# Altium project DTCP v2.0.PrjPcb
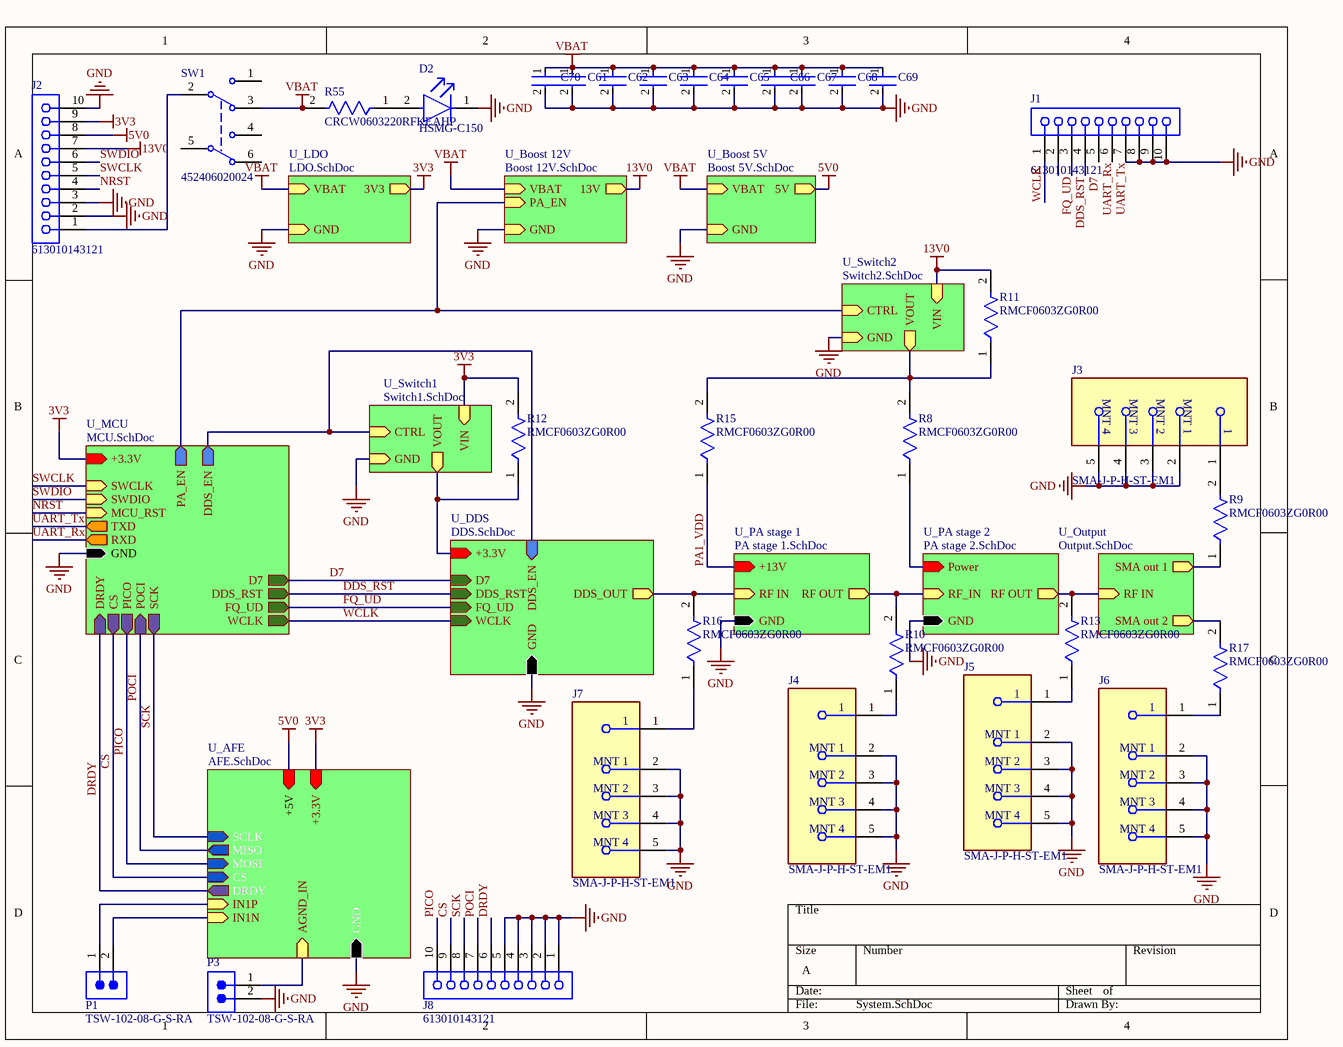
[diagram p0: System.SchDoc]
6 sheets, 109 parts. Net scope: hierarchical (ports join the sheet entries above them; power ports are global).
Board file: PCB1.PcbDoc
Sheets:
  System.SchDoc
    U_MCU = MCU.SchDoc
    U_DDS = DDS.SchDoc
    U_PA stage 2 = PA stage 2.SchDoc
    U_Output = Output.SchDoc
    U_AFE = AFE.SchDoc

## Sheet System.SchDoc
size A; SheetNumber: 1; SheetTotal: 12

### Parts
C61  GRM21BR60J107ME15K  [FP-GRM21B-0_2-e0_2_0_7-IPC_B]  (value not drawn)
C62  GRM21BR60J107ME15K  [FP-GRM21B-0_2-e0_2_0_7-IPC_B]  (value not drawn)
C63  GRM21BR60J107ME15K  [FP-GRM21B-0_2-e0_2_0_7-IPC_B]  (value not drawn)
C64  GRM21BR60J107ME15K  [FP-GRM21B-0_2-e0_2_0_7-IPC_B]  (value not drawn)
C65  GRM21BR60J107ME15K  [FP-GRM21B-0_2-e0_2_0_7-IPC_B]  (value not drawn)
C66  GRM21BR60J107ME15K  [FP-GRM21B-0_2-e0_2_0_7-IPC_B]  (value not drawn)
C67  GRM21BR60J107ME15K  [FP-GRM21B-0_2-e0_2_0_7-IPC_B]  (value not drawn)
C68  GRM21BR60J107ME15K  [FP-GRM21B-0_2-e0_2_0_7-IPC_B]  (value not drawn)
C69  GRM21BR60J107ME15K  [FP-GRM21B-0_2-e0_2_0_7-IPC_B]  (value not drawn)
C70  GRM21BR60J107ME15K  [FP-GRM21B-0_2-e0_2_0_7-IPC_B]  (value not drawn)
D2  HSMG-C150  [FP-HSMG-C150-MFG]
J1  613010143121  [613010143121]
J2  613010143121  [613010143121]
J3  SMA-J-P-H-ST-EM1  [FP-SMA-J-P-H-ST-EM1-MFG]
J4  SMA-J-P-H-ST-EM1  [FP-SMA-J-P-H-ST-EM1-MFG]
J5  SMA-J-P-H-ST-EM1  [FP-SMA-J-P-H-ST-EM1-MFG]
J6  SMA-J-P-H-ST-EM1  [FP-SMA-J-P-H-ST-EM1-MFG]
J7  SMA-J-P-H-ST-EM1  [FP-SMA-J-P-H-ST-EM1-MFG]
J8  613010143121  [613010143121]
P1  TSW-102-08-G-S-RA  [SMTC-TSW-102-08-X-S-RA]
P3  TSW-102-08-G-S-RA  [SMTC-TSW-102-08-X-S-RA]
R8  RMCF0603ZG0R00  [FP-RMCF0603-IPC_B]
R9  RMCF0603ZG0R00  [FP-RMCF0603-IPC_B]
R10  RMCF0603ZG0R00  [FP-RMCF0603-IPC_B]
R11  RMCF0603ZG0R00  [FP-RMCF0603-IPC_B]
R12  RMCF0603ZG0R00  [FP-RMCF0603-IPC_B]
R13  RMCF0603ZG0R00  [FP-RMCF0603-IPC_B]
R15  RMCF0603ZG0R00  [FP-RMCF0603-IPC_B]
R16  RMCF0603ZG0R00  [FP-RMCF0603-IPC_B]
R17  RMCF0603ZG0R00  [FP-RMCF0603-IPC_B]
R55  CRCW0603220RFKEAHP  [FP-CRCW0603-HPe3-IPC_A]
SW1  452406020024  [452406020024]

### Sub-sheets
U_AFE = AFE.SchDoc: +5V (in), GND (in), +3.3V (in), DRDY (out), CS (in), SCLK (in), MISO (out), MOSI (in), IN1P (in), IN1N (in), AGND_IN (in)
U_Boost 5V = Boost 5V.SchDoc (file not in this document): VBAT (in), GND (in), 5V (out)
U_Boost 12V = Boost 12V.SchDoc (file not in this document): VBAT (in), GND (in), 13V (out), PA_EN (in)
U_DDS = DDS.SchDoc: DDS_OUT (out), D7 (in), DDS_RST (in), FQ_UD (in), WCLK (in), +3.3V (in), GND (in), DDS_EN (in)
U_LDO = LDO.SchDoc (file not in this document): VBAT (in), GND (in), 3V3 (out)
U_MCU = MCU.SchDoc: +3.3V (in), GND (in), SWCLK (in), SWDIO (in), MCU_RST (in), TXD (out), CS (out), PICO (out), POCI (in), SCK (out), D7 (out), DDS_RST (out), FQ_UD (out), WCLK (out), PA_EN (out), DDS_EN (out), DRDY (in), RXD (out)
U_Output = Output.SchDoc: RF IN (in), SMA out 1 (out), SMA out 2 (out)
U_PA stage 1 = PA stage 1.SchDoc (file not in this document): RF IN (in), RF OUT (out), GND (in), +13V (in)
U_PA stage 2 = PA stage 2.SchDoc: GND (in), RF OUT (out), Power (in), RF_IN (in)
U_Switch1 = Switch1.SchDoc (file not in this document): VIN (in), VOUT (out), CTRL (in), GND (in)
U_Switch2 = Switch2.SchDoc (file not in this document): VIN (in), VOUT (out), CTRL (in), GND (in)

### Nets
3V3: J2.9 R12.2 ; sheet U_MCU/+3.3V, sheet U_LDO/3V3, sheet U_Switch1/VIN, sheet U_AFE/+3.3V
3V3DDS: R12.1 ; sheet U_DDS/+3.3V, sheet U_Switch1/VOUT
5V0: J2.8 ; sheet U_Boost 5V/5V, sheet U_AFE/+5V
13V0: J2.7 R11.2 ; sheet U_Boost 12V/13V, sheet U_Switch2/VIN
13V0PA: R8.1 ; sheet U_PA stage 2/Power
GND: C61.2 C62.2 C63.2 C64.2 C65.2 C66.2 C67.2 C68.2 C69.2 C70.2 D2.1(C) J1.7 J1.8 J1.9 J1.10 J2.2 J2.3 J2.10 J3.2(MNT_1) J3.3(MNT_2) J3.4(MNT_3) J3.5(MNT_4) J4.2(MNT_1) J4.3(MNT_2) J4.4(MNT_3) J4.5(MNT_4) J5.2(MNT_1) J5.3(MNT_2) J5.4(MNT_3) J5.5(MNT_4) J6.2(MNT_1) J6.3(MNT_2) J6.4(MNT_3) J6.5(MNT_4) J7.2(MNT_1) J7.3(MNT_2) J7.4(MNT_3) J7.5(MNT_4) J8.1 J8.2 J8.3 J8.4 J8.5 P3.2 ; sheet U_MCU/GND, sheet U_DDS/GND, sheet U_PA stage 1/GND, sheet U_PA stage 2/GND, sheet U_LDO/GND, sheet U_Boost 12V/GND, sheet U_Switch1/GND, sheet U_Switch2/GND, sheet U_Boost 5V/GND, sheet U_AFE/GND
VBAT: C61.1 C62.1 C63.1 C64.1 C65.1 C66.1 C67.1 C68.1 C69.1 C70.1 R55.2 SW1.3 ; sheet U_LDO/VBAT, sheet U_Boost 12V/VBAT, sheet U_Boost 5V/VBAT
CS: J8.9 ; sheet U_MCU/CS, sheet U_AFE/CS
D7: J1.4 ; sheet U_MCU/D7, sheet U_DDS/D7
DDS_OUT: R16.2 ; sheet U_DDS/DDS_OUT, sheet U_PA stage 1/RF IN
DDS_RST: J1.3 ; sheet U_MCU/DDS_RST, sheet U_DDS/DDS_RST
DRDY: J8.6 ; sheet U_MCU/DRDY, sheet U_AFE/DRDY
FQ_UD: J1.2 ; sheet U_MCU/FQ_UD, sheet U_DDS/FQ_UD
IN-: P1.1 ; sheet U_AFE/IN1P
NRST: J2.4 ; sheet U_MCU/MCU_RST
PA1_VDD: R15.1 ; sheet U_PA stage 1/+13V
PICO: J8.10 ; sheet U_MCU/PICO, sheet U_AFE/MOSI
POCI: J8.7 ; sheet U_MCU/POCI, sheet U_AFE/MISO
SCK: J8.8 ; sheet U_MCU/SCK, sheet U_AFE/SCLK
SWCLK: J2.5 ; sheet U_MCU/SWCLK
SWDIO: J2.6 ; sheet U_MCU/SWDIO
UART_Rx: J1.5 ; sheet U_MCU/RXD
UART_Tx: J1.6 ; sheet U_MCU/TXD  [project net TXD]
WCLK: J1.1 ; sheet U_MCU/WCLK, sheet U_DDS/WCLK  [project net DDS_WCLK]
NetC39_1: R10.2 ; sheet U_PA stage 1/RF OUT, sheet U_PA stage 2/RF_IN
NetC40_2: R13.2 ; sheet U_PA stage 2/RF OUT, sheet U_Output/RF IN
NetD2_2: D2.2(A) R55.1
NetJ2_1: J2.1 SW1.2(COM)
NetJ3_1: J3.1 R9.2
NetJ4_1: J4.1 R10.1
NetJ5_1: J5.1 R13.1
NetJ6_1: J6.1 R17.1
NetJ7_1: J7.1 R16.1
NetL14_1: R9.1 ; sheet U_Output/SMA out 1
NetL15_1: R17.2 ; sheet U_Output/SMA out 2
NetP1_2: P1.2 ; sheet U_AFE/IN1N
NetP3_1: P3.1 ; sheet U_AFE/AGND_IN
NetR8_2: R8.2 R11.1 R15.2 ; sheet U_Switch2/VOUT
NetU1_3: sheet U_MCU/PA_EN, sheet U_Boost 12V/PA_EN, sheet U_Switch2/CTRL
NetU1_8: sheet U_MCU/DDS_EN, sheet U_DDS/DDS_EN, sheet U_Switch1/CTRL

Not connected (* = marked no-connect by the designer): SW1 1 4 5(COM) 6

### Library data of the parts
C61-C70 = CMP-06035-052658-1: Chip Multilayer Ceramic Capacitors for General Purpose, 0805, 100uF, X5R, 15%, 20%, 6.3V; Voltage Rating (DC): 6.3V; Lead Free: Lead Free; Length: 2mm; Tolerance: 20%; Width: 1.25mm; Capacitance: 100uF; Dielectric: X5R; Thickness: 1.25mm
D2 = CMP-2000-05061-2: LED GREEN DIFFUSED 1206 SMD; Manufacturer: Broadcom; Led Orientation: Top View; Max Junction Temp: +95°C; Peak Emmision Wavelength: 570nm; Viewing Angle: 170°; Wavelength: 572nm; Reverse Voltage: 5V; Luminous Intensity: 15mcd; Forward Voltage: 2.2V; Power Dissipation: 65mW; Forward Current: 20mA; ComponentLink2Description: Datasheet; Lead Free: Yes; Temperature Range Low: -40°C; Package: HSMG-C150; Digikey Description: LED GREEN DIFFUSED 1206 SMD; Mouser Description: LED Uni-Color Green 570nm 2-Pin Chip LED T/R; Manufacturer Part Number: HSMG-C150; Temperature Range High: +85°C; Device Class L1: Optoelectronics; Colour: Green; Category: Diode; Device Class L3: unset; RoHS: TRUE; Height: 1.2mm; ComponentLink2URL: https://docs.broadcom.com/docs/AV02-0551EN; Device Class L2: LEDs; Automotive: No; Ipc Land Pattern Name: DIOCP320160X55; Octopart: https://octopart.com/hsmg-c150-broadcom-71131304; Temperature: -40°C to +85°C
J1 J2 J8 = CMP-1502-01419-3: NexarPartId: 18818161; Operating Supply Voltage: 250V; Contact Resistance: 20mΩ; Gender: Female; Insulation Resistance: 1GΩ; Connector Type: Header, Socket; Insulation: Insulated; Current Rating: 3A; Number of Positions: 10; Pitch: 2.54mm; Number of Rows: 1; Number of Pins: 10; Voltage Rating: 250V; Length: 25.9mm; Contact Gender: Female; RoHS: Compliant; Contact Plating: Gold; Height: 8.5mm; Min Operating Temperature: -40°C; Contact Material: Copper; Number of Contacts: 10; REACH SVHC: Unknown; Mount: Through Hole; Lead Pitch: 2.54mm; Width: 25.9mm; Max Operating Temperature: 125°C; Flammability Rating: UL94 V-0; Termination: Through Hole; Color: Black; Housing Material: PBT
J3-J7 = CMP-02754-000006-1: CONN SMA JACK STR 50OHM EDGE MNT; Dielectric Material: PTFE; Center Contact Plating: Gold; Max Frequency: 6GHz; Body Material: Brass; Voltage Rating: 335V; Impedance: 50R; Package Quantity: 1; Case/Package: SMA; Max Operating Temperature: 125°C; Fastening Type: Threaded; Orientation: Straight; Depth: 13.33mm; RoHS Compliant: Yes; Length: 6.35mm; Insulation Material: Polytetrafluoroethylene; Termination: Solder; Min Operating Temperature: -65°C; Housing Color: Gold; Contact Plating: Gold; Contact Material: Copper; Connector Type: SMA; Mount: Edge; Series: SMA; Packaging: Tray; Body Plating: Gold; Radiation Hardening: No
P1 P3 = CMP-1024-00320-1: 0.025" SQ Post Header, Through-hole, Right Angle, -55 to 125 degC, 2.54 mm Pitch, 2-Pin, Male, RoHS; Manufacturer: Samtec; Pitch: 2.54 mm; Temperature Range: -55 to 125 degC; PackageDescription: .025[0.64] SQ. Post Terminal Strip Assembly; ComponentLink3Description: Package Specification; ComponentLink2Description: Datasheet; PackageReference: TSW-102-08-X-S-RA; ComponentLink1Description: Manufacturer URL; ComponentLink2URL: http://www.samtec.com/documents/webfiles/pdf/TSW_TH.PDF; PackageVersion: DM, 8/1988; RoHS: True; PartNumber: TSW-102-08-G-S-RA; Mounting Technology: Through-hole; Orientation: Right Angle; ComponentLink1URL: http://www.samtec.com; DatasheetVersion: F-214; ComponentLink3URL: http://www.samtec.com/documents/webfiles/cpdf/TSW-XXX-XX-XXX-X-XX-XXX-MKT.pdf
R8-R13 R15-R17 = CMP-26527-006412-1: 0Ω ±0 0.1W 0603 Thick Film Chip Resistor AEC-Q200 compliant; Max Power Dissipation: 100mW; Resistance: 0R; Width: 0.031inch; RoHS Compliant: Yes; Number of Terminations: 2; Case/Package: 0603; Contact Plating: Tin; Height: 0.022inch; Resistor Type: Thick Film; Mount: Surface Mount; Length: 0.061inch; Features: Automotive AEC-Q200; Series: RMCF; Max Operating Temperature: 155°C; Radiation Hardening: No; Min Operating Temperature: -55°C; Packaging: Tape and Reel
R55 = CMP-02407-003593-1: RES Thick Film, 220Ω, 1%, 0.33W, 100ppm/°C, 0603; Max Power Dissipation: 250mW; Voltage Rating (DC): 75V; Resistance: 220R; Radiation Hardening: No; Contact Plating: Tin; Length: 1.6mm; Depth: 0.85mm; Composition: Thick Film; Lead Free: Lead Free; Mount: Surface Mount; Package Quantity: 5000; Height: 0.45mm; Termination: SMD/SMT; Weight: 7.1E-05oz; Military Standard: Not; Number of Terminations: 2; Case Code (Metric): 1608; Max Operating Temperature: 155°C; Power Rating: 250mW; Tolerance: 1%; Temperature Coefficient: 100ppm/°C; Features: Automotive AEC-Q200; Case Code (Imperial): 0603; Width: 0.033inch; Min Operating Temperature: -55°C; Case/Package: 0603; Voltage Rating: 75V; Packaging: Tape and Reel
SW1 = CMP-03913-146831046-1: Ws-slsv_smt Mini Slide Switch Sa

## Sheet MCU.SchDoc
size A; SheetNumber: 2; SheetTotal: 12
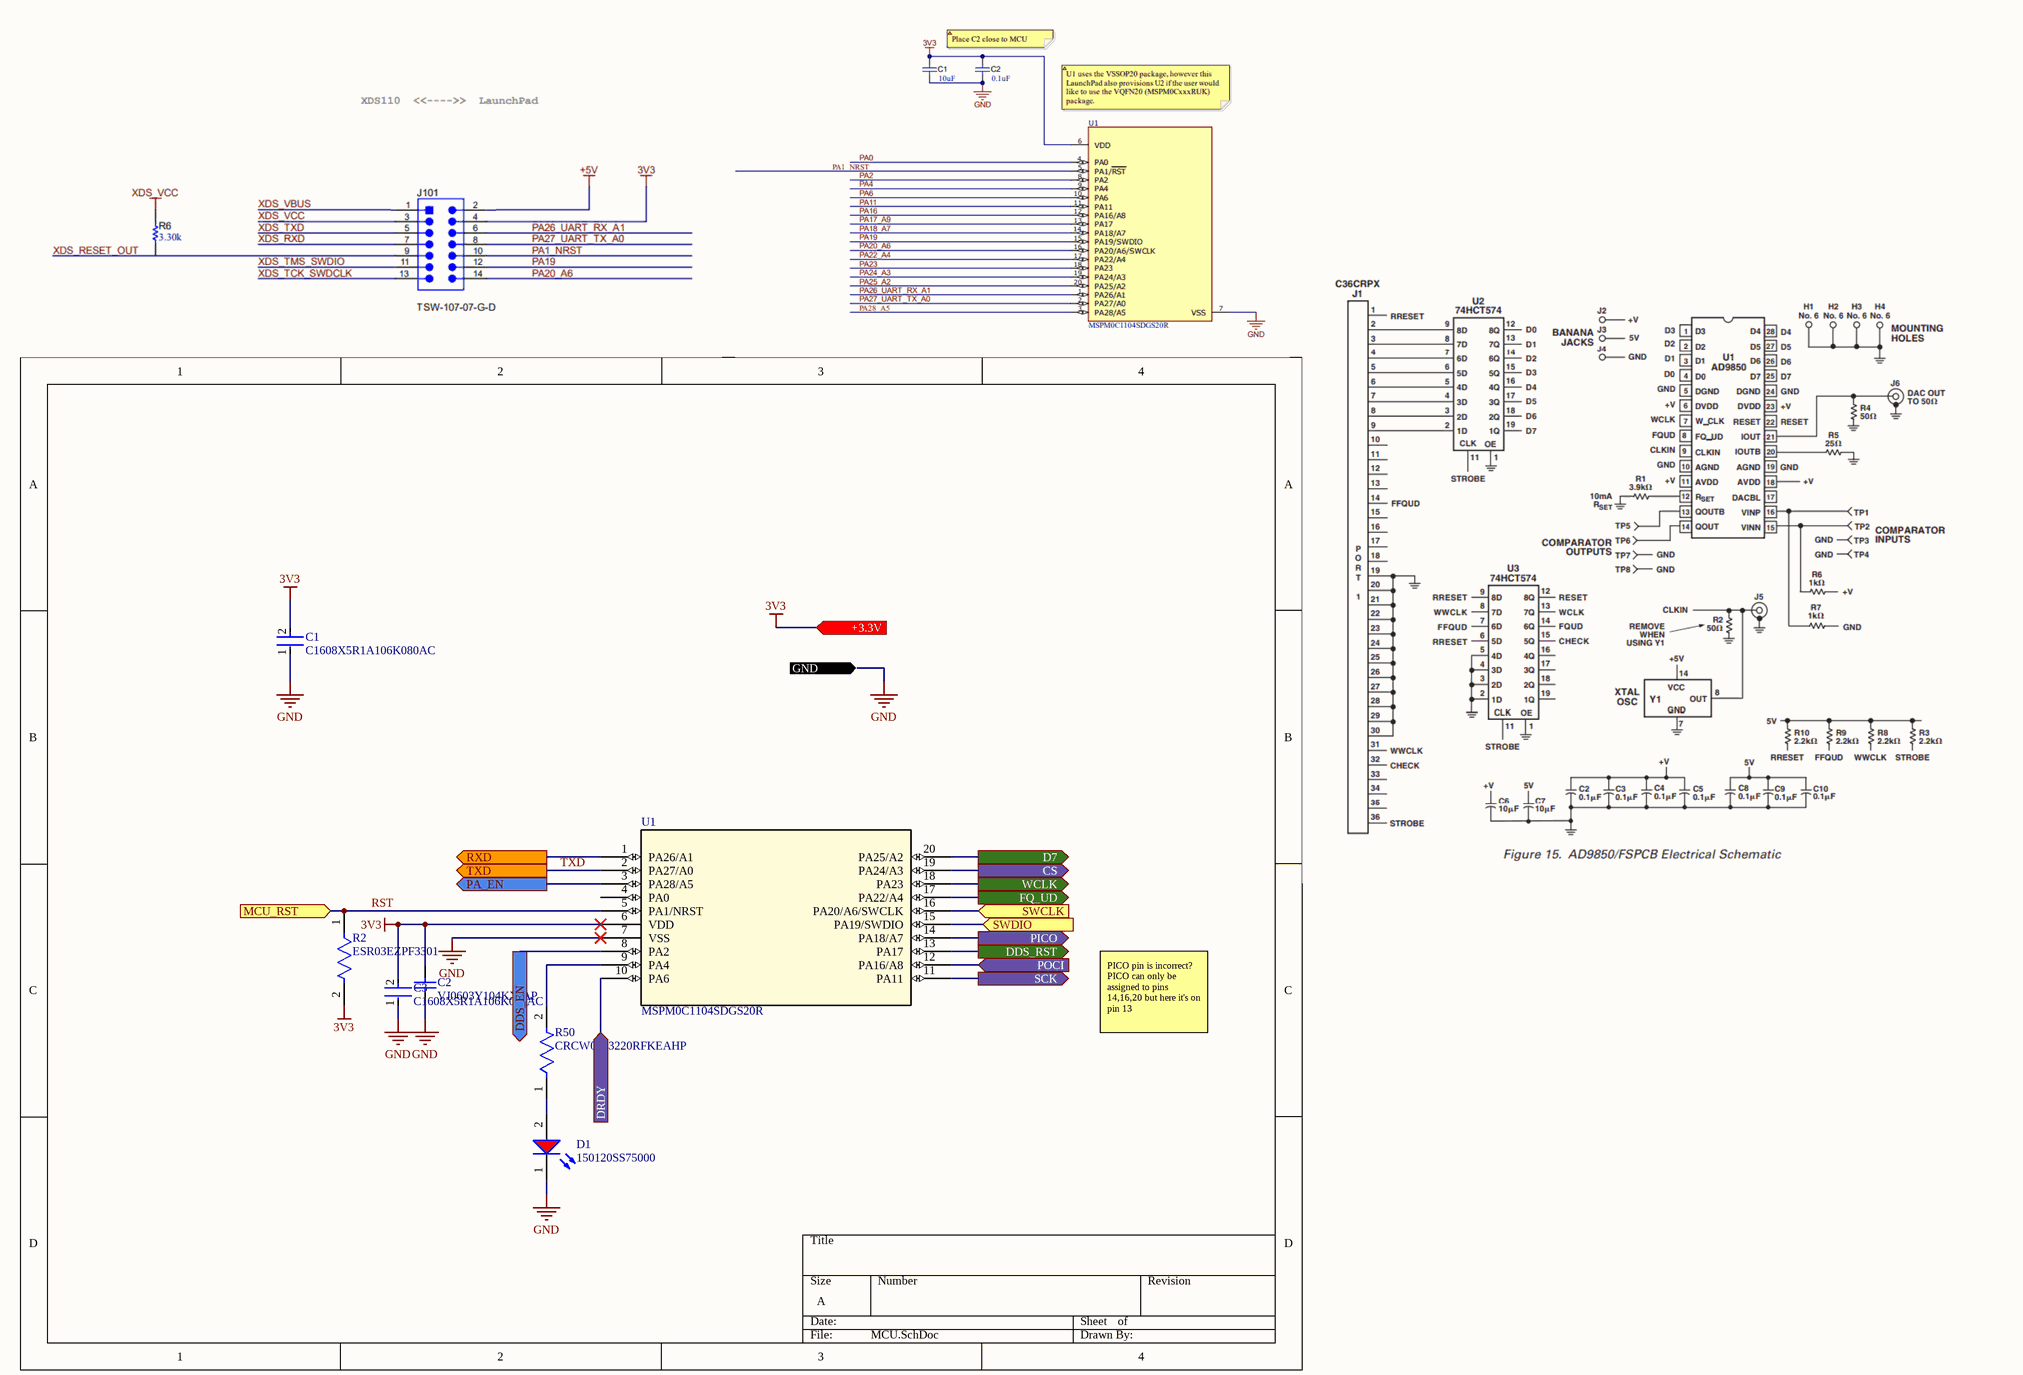
[diagram p1: MCU.SchDoc]

### Parts
C1  C1608X5R1A106K080AC  [FP-C1608-080-0_1-MFG]
C2  VJ0603Y104KXJAP  [CAPC1608X92X38NL15T08]
C3  C1608X5R1A106K080AC  [FP-C1608-080-0_1-MFG]
D1  150120SS75000  [WL-SMCW_1206_150120xx75000]
R2  ESR03EZPF3301  [FP-ESR03-IPC_A]
R50  CRCW0603220RFKEAHP  [FP-CRCW0603-HPe3-IPC_A]
U1  MSPM0C1104SDGS20R  [DGS0020A_TEX]

### Ports
+3.3V (in), CS (out), D7 (out), DDS_EN (out), DDS_RST (out), DRDY (in), FQ_UD (out), GND (in), MCU_RST (in), PA_EN (out), PICO (out), POCI (in), RXD (out), SCK (out), SWCLK (in), SWDIO (in), TXD (out), WCLK (out)

### Nets
3V3: C1.2 C2.2 C3.2 R2.2 U1.6(VDD) ; port +3.3V
GND: C1.1 C2.1 C3.1 D1.1(K) U1.7(VSS) ; port GND
CS: U1.19(PA24/A3) ; port CS
D7: U1.20(PA25/A2) ; port D7
DDS_RST: U1.13(PA17) ; port DDS_RST
DDS_WCLK: U1.18(PA23) ; port WCLK
DRDY: U1.10(PA6) ; port DRDY
FQ_UD: U1.17(PA22/A4) ; port FQ_UD
PICO: U1.14(PA18/A7) ; port PICO
POCI: U1.12(PA16/A8) ; port POCI
RST: R2.1 U1.5(PA1/NRST) ; port MCU_RST  [project net NRST]
SCK: U1.11(PA11) ; port SCK
SWCLK: U1.16(PA20/A6/SWCLK) ; port SWCLK
SWDIO: U1.15(PA19/SWDIO) ; port SWDIO
TXD: U1.2(PA27/A0) ; port TXD
UART_Rx: U1.1(PA26/A1) ; port RXD
NetD1_2: D1.2(A) R50.1
NetR50_2: R50.2 U1.9(PA4)
NetU1_3: U1.3(PA28/A5) ; port PA_EN
NetU1_8: U1.8(PA2) ; port DDS_EN

Not connected (* = marked no-connect by the designer): U1 4(PA0)

### Notes on the sheet
- PICO pin is incorrect? PICO can only be assigned to pins 14,16,20 but here it's on pin 13

### Library data of the parts
C1 C3 = CMP-2000-04979-3: Multilayer Ceramic Capacitors 10μF ±10% 10V X5R SMD 0603; Capacitance: 10uF; Dielectric Material: Ceramic; Construction: Flat; Height: 0.8mm; Thickness: 0.035inch; Case Code (Metric): 1608; Radiation Hardening: No; Number of Pins: 2; Voltage Rating (DC): 10V; Depth: 0.8mm; Voltage: 10V; RoHS Compliant: Yes; Voltage Rating: 10V; Package Quantity: 1; Resistor Type: Ceramic; Termination: SMD/SMT; Lead Free: Lead Free; REACH SVHC: No SVHC; Tolerance: 10%; Mount: Surface Mount; Series: C; Packaging: Tape and Reel; Width: 0.8mm; Dielectric: X5R; Weight: 7.1E-05oz; Length: 1.6mm; Max Operating Temperature: 85°C; Case Code (Imperial): 0603; Case/Package: 0603; Min Operating Temperature: -55°C
C2 = CMP-2006-01211-1: Manufacturer: Vitramon; Part Number: VJ0603Y104KXJAP
D1 = CMP-1426-00017-3: Led, Red, 630 Nm, 1.9 V, 30 Ma, 60 Mcd Rohs Compliant: Yes; Forward Current: 100mA; Max Reverse Voltage (DC): 5V; Lens Style: Clear, Rectangular; Viewing Angle: 140°; Luminous Intensity: 60mcd; Peak Wavelength: 645nm; Forward Voltage: 1.9V; Test Current: 20mA; Dominant Wavelength: 630nm; Case Code (Imperial): 1206; Length: 3.2mm; Mount: Surface Mount; Case Code (Metric): 3216; Case/Package: 1206; Min Operating Temperature: -40°C; Width: 1.6mm; Color: Red; Height: 680µm; REACH SVHC: Unknown; Max Operating Temperature: 85°C; Wavelength: 630nm; RoHS: Compliant; Packaging: Tape and Reel
R2 = CMP-08839-028747-1: 3.3kΩ ±1% 0.25W 0603 Anti-Surge Chip Resistor AEC-Q200; Temperature Coefficient: 100ppm/°C; Resistance: 3.3kR; Max Power Dissipation: 250mW; Tolerance: 1%; Min Operating Temperature: -55°C; Features: Automotive AEC-Q200; Max Operating Temperature: 155°C; Number of Terminations: 2; Series: ESR; Packaging: Tape and Reel; Resistor Type: Thick Film; RoHS Compliant: Yes; Case/Package: 0603
R50 = CMP-02407-003593-1: as R55 on sheet System; Radiation Hardening: No; Contact Plating: Tin; Length: 1.6mm; Depth: 0.85mm; Composition: Thick Film; Lead Free: Lead Free; Mount: Surface Mount; Package Quantity: 5000; Height: 0.45mm; Termination: SMD/SMT; Weight: 7.1E-05oz; Military Standard: Not; Number of Terminations: 2; Case Code (Metric): 1608; Max Operating Temperature: 155°C; Power Rating: 250mW; Tolerance: 1%; Temperature Coefficient: 100ppm/°C; Features: Automotive AEC-Q200; Case Code (Imperial): 0603; Width: 0.033inch; Min Operating Temperature: -55°C; Case/Package: 0603; Voltage Rating: 75V; Packaging: Tape and Reel
U1 = MSPM0C1104SDGS20R: 24MHz ArmÂ® CortexÂ®-M0+ MCU with 16KB flash, 1KB SRAM, 12-bit ADC 20-VSSOP -40 to 125; Manufacturer_Name: Texas Instruments; Copyright: Copyright (C) 2025 Ultra Librarian. All rights reserved.; Manufacturer_Part_Number: MSPM0C1104SDGS20R; Datasheet: https://www.ti.com/lit/gpn/mspm0c1104; RefDes: RefDes; Type: Type

## Sheet DDS.SchDoc
size A; SheetNumber: 5; SheetTotal: 12
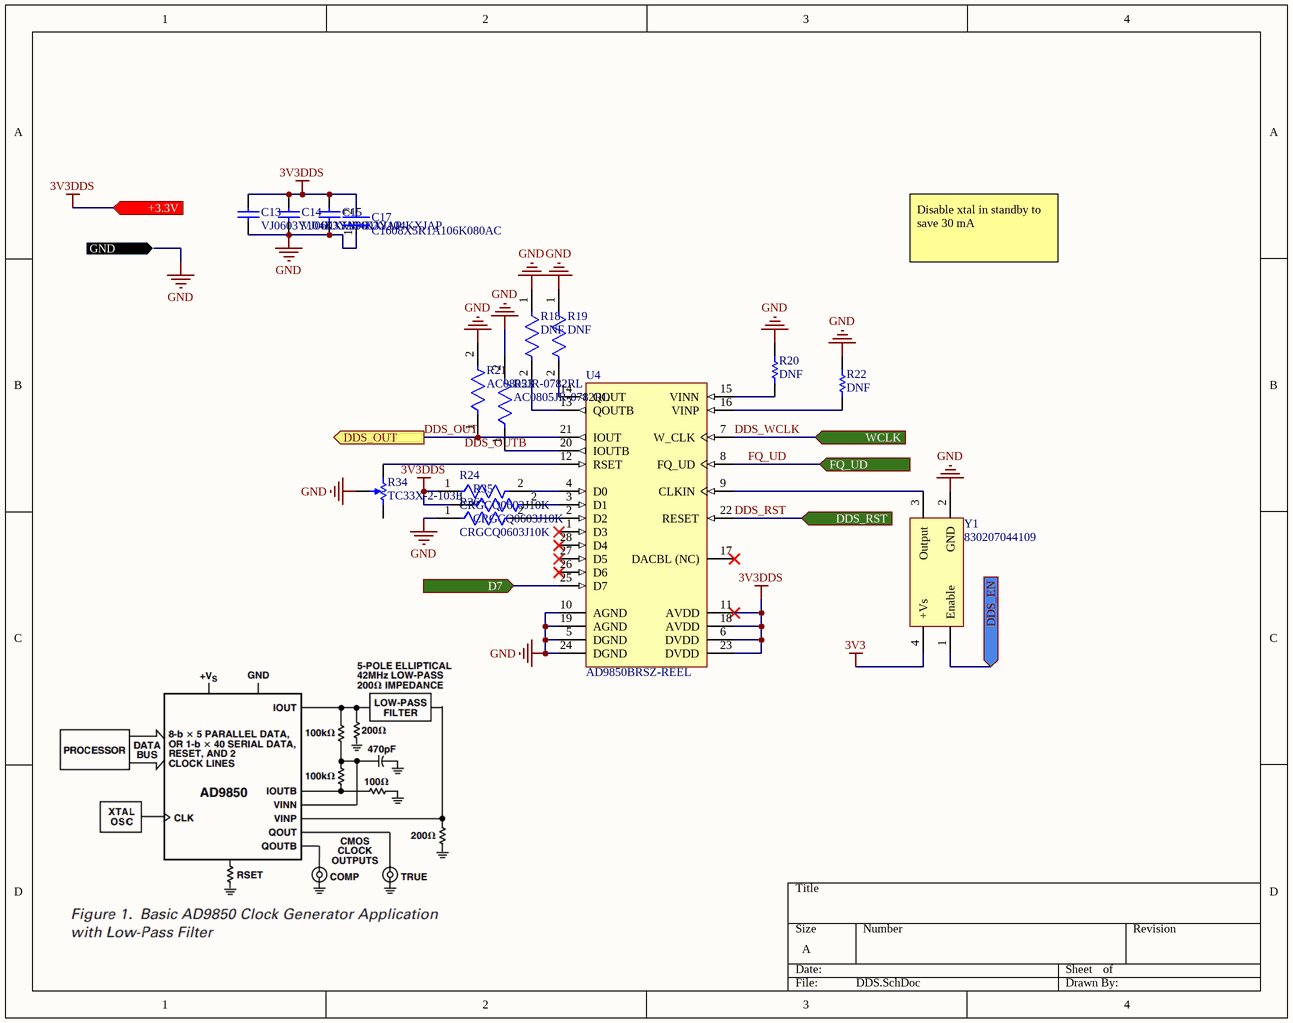
[diagram p2: DDS.SchDoc]

### Parts
C13  VJ0603Y104KXJAP  [CAPC1608X92X38NL15T08]
C14  VJ0603Y104KXJAP  [CAPC1608X92X38NL15T08]
C15  VJ0603Y104KXJAP  [CAPC1608X92X38NL15T08]
C17  C1608X5R1A106K080AC  [FP-C1608-080-0_1-MFG]
R18  DNF  [FP-RMCF0603-IPC_B]
R19  DNF  [FP-RMCF0603-IPC_B]
R20  DNF  [RESC0603(1608)_N]
R21  AC0805JR-0782RL  [FP-AC0805-MFG]
R22  DNF  [RESC0603(1608)_N]
R23  AC0805JR-0782RL  [FP-AC0805-MFG]
R24  CRGCQ0603J10K  [FP-CRGCQ0603-IPC_C]
R34  TC33X-2-103E  [BOUR-TC33X-2_V]
R35  CRGCQ0603J10K  [FP-CRGCQ0603-IPC_C]
R36  CRGCQ0603J10K  [FP-CRGCQ0603-IPC_C]
U4  AD9850BRSZ-REEL  [ADI-RS-28_N]
Y1  830207044109  [WE-SPXO_CFPS-39]

### Ports
+3.3V (in), D7 (in), DDS_EN (in), DDS_OUT (out), DDS_RST (in), FQ_UD (in), GND (in), WCLK (in)

### Nets
3V3: Y1.4(+Vs)
3V3DDS: C13.2 C14.2 C15.2 C17.2 R24.1 R35.1 U4.6(DVDD) U4.11(AVDD) U4.18(AVDD) U4.23(DVDD) ; port +3.3V
GND: C13.1 C14.1 C15.1 C17.1 R18.1 R19.1 R20.2 R21.2 R22.2 R23.2 R34.2 R36.1 U4.5(DGND) U4.10(AGND) U4.19(AGND) U4.24(DGND) Y1.2(GND) ; port GND
D7: U4.25(D7) ; port D7
DDS_OUT: R21.1 U4.21(IOUT) ; port DDS_OUT
DDS_RST: U4.22(RESET) ; port DDS_RST
DDS_WCLK: U4.7(W_CLK) ; port WCLK
FQ_UD: U4.8(FQ_UD) ; port FQ_UD
NetR18_2: R18.2 U4.13(QOUTB)
NetR19_2: R19.2 U4.14(QOUT)
NetR20_1: R20.1 U4.15(VINN)
NetR22_1: R22.1 U4.16(VINP)
NetR23_1: R23.1 U4.20(IOUTB)
NetR24_2: R24.2 U4.4(D0)
NetR34_1: R34.1 U4.12(RSET)
NetR35_2: R35.2 U4.3(D1)
NetR36_2: R36.2 U4.2(D2)
NetU1_8: Y1.1(Enable) ; port DDS_EN
NetU4_9: U4.9(CLKIN) Y1.3(Output)

Not connected (* = marked no-connect by the designer): R34 3; U4 1(D3)* 17(DACBL_(NC))* 26(D6)* 27(D5)* 28(D4)*

### Notes on the sheet
- Disable xtal in standby to save 30 mA
- Labels drawn without touching a wire or pin: DDS_OUTB

### Library data of the parts
C13-C15 = CMP-2006-01211-1: Manufacturer: Vitramon; Part Number: VJ0603Y104KXJAP
C17 = CMP-2000-04979-3: as C1 on sheet MCU; Dielectric Material: Ceramic; Construction: Flat; Height: 0.8mm; Thickness: 0.035inch; Case Code (Metric): 1608; Radiation Hardening: No; Number of Pins: 2; Voltage Rating (DC): 10V; Depth: 0.8mm; Voltage: 10V; RoHS Compliant: Yes; Voltage Rating: 10V; Package Quantity: 1; Resistor Type: Ceramic; Termination: SMD/SMT; Lead Free: Lead Free; REACH SVHC: No SVHC; Tolerance: 10%; Mount: Surface Mount; Series: C; Packaging: Tape and Reel; Width: 0.8mm; Dielectric: X5R; Weight: 7.1E-05oz; Length: 1.6mm; Max Operating Temperature: 85°C; Case Code (Imperial): 0603; Case/Package: 0603; Min Operating Temperature: -55°C
R18 R19 = CMP-26527-006412-1: as R8 on sheet System; Width: 0.031inch; RoHS Compliant: Yes; Number of Terminations: 2; Case/Package: 0603; Contact Plating: Tin; Height: 0.022inch; Resistor Type: Thick Film; Mount: Surface Mount; Length: 0.061inch; Features: Automotive AEC-Q200; Series: RMCF; Max Operating Temperature: 155°C; Radiation Hardening: No; Min Operating Temperature: -55°C; Packaging: Tape and Reel
R20 R22 = CMP-1012-00736-1: 100K 0.1W 1% 0603 (1608 Metric)  SMD; Value: 100000.00 Ohm; Case-Metric: 1608; Case-EIA: 0603; Power: 0.1 W; Tolerance: 1 %; Technology: SMT
R21 R23 = CMP-03412-037249-1: RES SMD 82 OHM 5% 1/8W 0805; Manufacturer: Yageo; Tolerance: 0.05; Value: 82Ω; Automotive Grade: Grade 0; Voltage Rating: 150V; Footprint Url: http://www.yageo.com/exep/pages/download/literatures/PYu-R_Mount_10.pdf; Ipc Land Pattern Name: RESC200125X50; Package: AC0805; Category: Res; Height: 0.6mm; Temperature Range High: +155°C; Digikey Description: RES SMD 82 OHM 5% 1/8W 0805; Device Class L2: Resistors; Power Rating: 1/8W; ComponentLink2URL: http://www.yageo.com/documents/recent/PYu-AC_51_RoHS_L_6.pdf; Mouser Description: Thick Film Resistors - SMD 1/8W 82ohm 5% AEC-Q200; Temperature: -55°C to +155°C; Octopart: https://octopart.com/ac0805jr-0782rl-yageo-71367939; Resistance: 82Ω; Composition: Thick Film; Device Class L3: Chip SMD Resistors; ComponentLink2Description: Datasheet; Device Class L1: Passive Components; Series: AC; Temperature Range Low: -55°C; RoHS: TRUE; Lead Free: Yes; Manufacturer Part Number: AC0805JR-0782RL; Automotive: Yes
R24 R35 R36 = CMP-03211-009884-1: CRGCQ 0603 10K 5%; Manufacturer: TE Connectivity; Tolerance: 0.05; Power Rating: 0.1W; Resistance: 10KΩ; Voltage Rating: 75V; Value: 10KΩ; Temperature Coefficient: ±100ppm/°C; Composition: Thick Film; ComponentLink2URL: https://www.te.com/commerce/DocumentDelivery/DDEController?Action=showdoc&DocId=Data+Sheet%7F1773204-3%7F1%7Fpdf%7FEnglish%7FENG_DS_1773204-3_1.pdf%7F4-2176339-923; Device Class L1: Passive Components; Package: CRGCQ0603; Mouser Description: Res Thick Film 0603 10K Ohm 5% 0.1W(1/10W) ±100ppm/C Pad SMD Automotive T/R; Temperature Range High: +155°C; Category: Res; Device Class L2: Resistors; Height: 0.55mm; RoHS: TRUE; Lead Free: Yes; Ipc Land Pattern Name: RESC16080X45; Temperature: -55°C to +155°C; Series: CRGCQ; Digikey Description: CRGCQ 0603 10K 5%; Octopart: https://octopart.com/crgcq0603j10k-te+connectivity-91018097; Device Class L3: Chip SMD Resistors; Ambient Temperature Range High: +70°C; ComponentLink2Description: Datasheet; Temperature Range Low: -55°C; Manufacturer Part Number: CRGCQ0603J10K
R34 = CMP-2100-03695-1: Trimming Potentiometer, 10000 Ohm, -40 to 100 degC, 3-Pin SMD, RoHS, Tape and Reel; Manufacturer: Bourns; Tolerance: 25%; Max Power Dissipation: 100mW; Number of Turns: 1; Resistance: 10KOhm; Temperature Coefficient: 250ppm/degreesC; Voltage Rating (DC): 50V; Datasheet URL: http://www.bourns.com/docs/Product-Datasheets/TC33.pdf; Composition: Potentiometer; Package Description: 3-Pin Surface Mount Device, Body 3.8 x 3.6 mm; Weight: 29.4mg; Power Rating: 100mW; Termination: FootPrint; Manufacturer URL: http://www.bourns.com/; Width: 0.118inch; Height: 0.047inch; Military Standard: Not; Radiation Hardening: No; Colour: Silver; Case/Package: SMD/SMT; Depth: 3.8mm; Min Operating Temperature: -40degC; Lead Free: LeadFree; Datasheet Version: 42583.0; REACH SVHC: NoSVHC; Length: 3mm; RoHSCompliant: true; Contact Plating: Silver; Taper: Linear; Packaging: TapeandReel; Mount: SurfaceMount; Max Operating Temperature: 100degC; Package Reference: TC33X-2; Package Quantity: 2500
U4 = CMP-0293-00041-1: CMOS, 125 MHz Complete DDS Synthesizer, 10-Bit, Parallel, Serial, RS-28, 1500 Reel, Pb-Free; Tuning Word Width (bits): 32bit; Master fclk: 125MHz; Resolution (Bits): 10bit; REFCLK Multiplier: No; Compliance Range (V): 1.5V; FS Iout (mA nom): 20mA; I Supply total (max): 96mA; ComponentLink3Description: Package Specification; Code_JEDEC: MO-150-AH; ComponentLink1URL: www.analog.com; I/O Interface: Parallel, Serial; PackageDescription: 28-Lead Shrink Small Outline Package [SSOP]; ComponentLink2URL: http://www.analog.com/static/imported-files/data_sheets/AD9850.pdf; ComponentLink3URL: http://www.analog.com/static/imported-files/packages/32122249223724RS_28.pdf; ComponentLink2Description: Datasheet; PackageVersion: revA, 1997; ComponentLink1Description: Manufacturer URL; PackageReference: RS-28; DatasheetVersion: Rev. H
Y1 = CMP-03913-116855802-1: 830207044109 WE-SPXO Crystal Oscillator; Frequency: 100MHz; NexarPartId: 116855802; Length: 3.2mm; Width: 2.5mm; Max Operating Temperature: 85°C; Height: 1.2mm; Min Operating Temperature: -40°C

## Sheet PA stage 2.SchDoc
size A; SheetNumber: 9; SheetTotal: 12
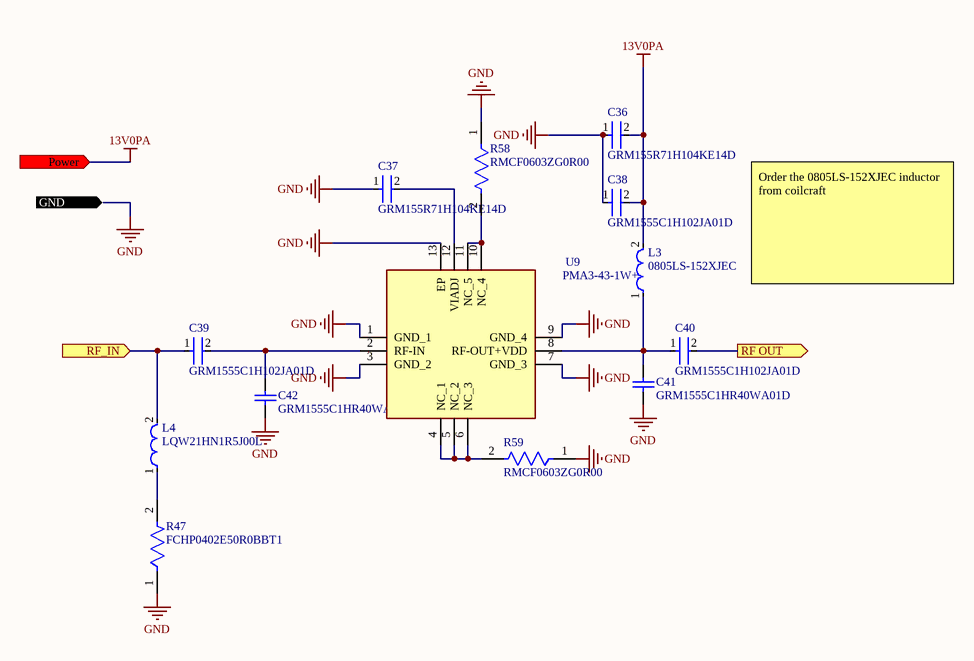
[diagram p3: PA stage 2.SchDoc]

### Parts
C36  GRM155R71H104KE14D  [FP-GRM155-0_05-IPC_B]
C37  GRM155R71H104KE14D  [FP-GRM155-0_05-IPC_B]
C38  GRM1555C1H102JA01D  [FP-GRM155-0_05-IPC_B]
C39  GRM1555C1H102JA01D  [FP-GRM155-0_05-IPC_B]
C40  GRM1555C1H102JA01D  [FP-GRM155-0_05-IPC_B]
C41  GRM1555C1HR40WA01D  [CAPC1005X55X25LL05T10]
C42  GRM1555C1HR40WA01D  [CAPC1005X55X25LL05T10]
L3  0805LS-152XJEC  [FP-LQW21HN_00-MFG]
L4  LQW21HN1R5J00L  [FP-LQW21HN_00-MFG]
R47  FCHP0402E50R0BBT1  [FP-FC0402-MFG]
R58  RMCF0603ZG0R00  [FP-RMCF0603-IPC_B]
R59  RMCF0603ZG0R00  [FP-RMCF0603-IPC_B]
U9  PMA3-43-1W+  [QFN51P300X300X89-13N]

### Ports
GND (in), Power (in), RF OUT (out), RF_IN (in)

### Nets
13V0PA: C36.2 C38.2 L3.2 ; port Power
GND: C36.1 C37.1 C38.1 C41.1 C42.1 R47.1 R58.1 R59.1 U9.1(GND_1) U9.3(GND_2) U9.7(GND_3) U9.9(GND_4) U9.13(EP) ; port GND
NetC37_2: C37.2 U9.12(VIADJ)
NetC39_1: C39.1 L4.2 ; port RF_IN
NetC39_2: C39.2 C42.2 U9.2(RF-IN)
NetC40_1: C40.1 C41.2 L3.1 U9.8(RF-OUT+VDD)
NetC40_2: C40.2 ; port RF OUT
NetL4_1: L4.1 R47.2
NetR58_2: R58.2 U9.10(NC_4) U9.11(NC_5)
NetR59_2: R59.2 U9.4(NC_1) U9.5(NC_2) U9.6(NC_3)

### Notes on the sheet
- Order the 0805LS-152XJEC inductor from coilcraft

### Library data of the parts
C36 C37 = CMP-2008-04639-2: Chip Multilayer Ceramic Capacitors for General Purpose, 0402, 0.10uF, X7R, 15%, 10%, 50V; Dissipation Factor: 0.025%; Capacitance: 100nF; Weight: 0.000212oz; Thickness: 0.022inch; Voltage Rating (DC): 50V; Dielectric Material: Ceramic; Termination: SMD/SMT; Case/Package: 0402; Case Code (Imperial): 0402; Mount: Surface Mount; REACH SVHC: No SVHC; Resistor Type: Ceramic; Dielectric: X7R; Max Operating Temperature: 125°C; Voltage: 50V; Lead Free: Lead Free; Package Quantity: 10000; Packaging: Tape and Reel; Length: 1mm; Material: Ceramic; Height: 0.5mm; Depth: 0.5mm; Width: 0.5mm; Min Operating Temperature: -55°C; Tolerance: 10%; Case Code (Metric): 1005; Voltage Rating: 50V
C38-C40 = CMP-2008-04254-2: Chip Multilayer Ceramic Capacitors for General Purpose, 0402, 1000pF, C0G, 30ppm/°C, 5%, 50V; Insulation Resistance: 10GR; Capacitance: 1nF; Packaging: Tape and Reel; Lead Free: Lead Free; Tolerance: 5%; Temperature Coefficient: 30ppm/°C; Thickness: 0.022inch; Termination: SMD/SMT; Max Operating Temperature: 125°C; Height: 0.5mm; Package Quantity: 1; Radiation Hardening: No; Material: Ceramic; Case Code (Metric): 1005; Number of Pins: 2; Voltage Rating: 50V; Mount: Surface Mount; Voltage: 50V; Case/Package: 0402; Min Operating Temperature: -55°C; Dielectric Material: Ceramic; Width: 0.5mm; Depth: 0.5mm; Case Code (Imperial): 0402; REACH SVHC: No SVHC; Dielectric: C0G; Voltage Rating (DC): 50V; Length: 1mm
C41 C42 = CMP-1034-00010-2: Manufacturer: Murata; Part Number: GRM1555C1HR40WA01D
L3 = CMP-06042-001639-1: 0805LS-152XJEC Coilcraft; Core Material: Ferrite; DC Current: 85mA; DC Resistance (DCR): 5.33R; Self Resonant Frequency: 350MHz; Shielding: Unshielded; Inductance: 1.5uH; Test Frequency: 10MHz; Tolerance: 5%; Q Factor: 35; Width: 0.047inch; Case Code (Metric): 2012; Current Rating: 85mA; Mount: Surface Mount; Max DC Current: 85mA; Length: 2mm; Height - Seated (Max): 0.039inch; Depth: 1.4mm; Min Operating Temperature: -40°C; Termination: SMD/SMT; Military Standard: Not; Radiation Hardening: No; Packaging: Tape and Reel; Resistor Type: Wirewound; Case/Package: 0805; Case Code (Imperial): 0805; Weight: 0.000282oz; Height: 0.9mm; Package Quantity: 3000; Max Operating Temperature: 85°C
L4 = CMP-06042-001639-1: Wire Wound Ferrite type RF Inuctor 1.5uH ±5% 85mA 5.33Ω 0805 (2012); DC Resistance (DCR): 5.33R; Self Resonant Frequency: 350MHz; Shielding: Unshielded; Test Frequency: 10MHz; Q Factor: 35; Width: 0.047inch; Core Material: Ferrite; Case Code (Metric): 2012; DC Current: 85mA; Current Rating: 85mA; Mount: Surface Mount; Max DC Current: 85mA; Length: 2mm; Height - Seated (Max): 0.039inch; Depth: 1.4mm; Min Operating Temperature: -40°C; Termination: SMD/SMT; Military Standard: Not; Radiation Hardening: No; Packaging: Tape and Reel; Resistor Type: Wirewound; Case/Package: 0805; Case Code (Imperial): 0805; Inductance: 1.5uH; Weight: 0.000282oz; Height: 0.9mm; Package Quantity: 3000; Max Operating Temperature: 85°C; Tolerance: 5%
R47 = CMP-05494-120702529-1: FCHP0402E50R0BBT1 SMD Chip Resistor, 50 Ohm, ± 0.1%, 1 W, 0402 [1005 Metric], Thin Film, High Frequency; Power Rating: 1W; Voltage Rating: 30V; Temperature Coefficient: 25ppm/°C; Resistance: 50Ω; Max Operating Temperature: 155°C; Min Operating Temperature: -55°C; Composition: Thin Film; Schedule B: 8533210045; Case/Package: 0402; Tolerance: 0.1%; Height: 419.1µm; NexarPartId: 120702529
R58 R59 = CMP-26527-006412-1: as R8 on sheet System; Width: 0.031inch; RoHS Compliant: Yes; Number of Terminations: 2; Case/Package: 0603; Contact Plating: Tin; Height: 0.022inch; Resistor Type: Thick Film; Mount: Surface Mount; Length: 0.061inch; Features: Automotive AEC-Q200; Series: RMCF; Max Operating Temperature: 155°C; Radiation Hardening: No; Min Operating Temperature: -55°C; Packaging: Tape and Reel
U9 = PMA3-43-1W+: Integrated Circuit; Manufacturer_Name: Mini-Circuits; Datasheet Link: https://www.minicircuits.com/pdfs/PMA3-43-1W+.pdf; Height: 0.89mm; Manufacturer_Part_Number: PMA3-43-1W+

## Sheet Output.SchDoc
size A; SheetNumber: 10; SheetTotal: 12
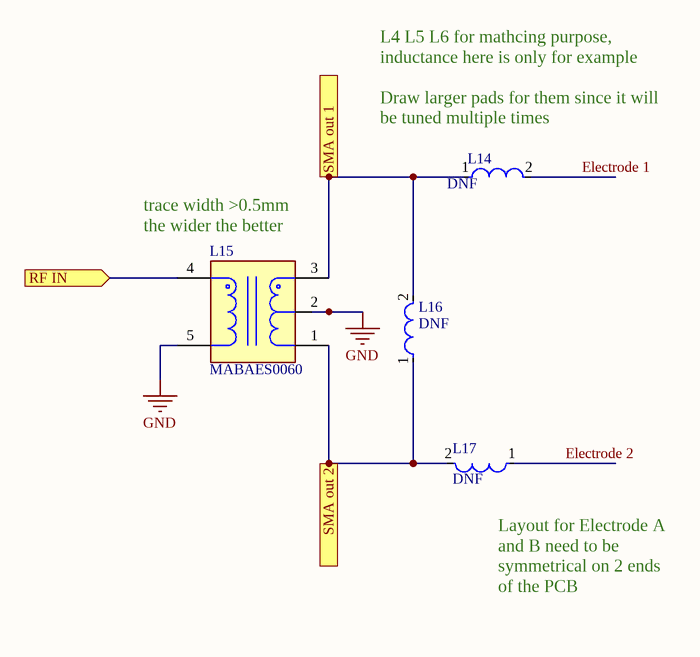
[diagram p4: Output.SchDoc]

### Parts
L14  DNF  [FP-MLZ2012-1_25-IPC_C]
L15  MABAES0060  [FP-MABAES0060-MFG]
L16  DNF  [FP-MLZ2012-1_25-IPC_C]
L17  DNF  [FP-MLZ2012-1_25-IPC_C]

### Ports
RF IN (in), SMA out 1 (out), SMA out 2 (out)

### Nets
GND: L15.2(Secondary_CT) L15.5(Primary)
Electrode 1: L14.2
Electrode 2: L17.1
NetC40_2: L15.4(Primary_dot) ; port RF IN
NetL14_1: L14.1 L15.3(Secondary_Dot) L16.2 ; port SMA out 1
NetL15_1: L15.1(Secondary) L16.1 L17.2 ; port SMA out 2

### Notes on the sheet
- (near L14) L4 L5 L6 for mathcing purpose, inductance here is only for example
  Draw larger pads for them since it will be tuned multiple times
- (near L15) trace width >0.5mm the wider the better
- (near L17) Layout for Electrode A and B need to be symmetrical on 2 ends of the PCB

### Library data of the parts
L14 L16 L17 = CMP-08253-000383-1: Shielded Multilayer Inductor 1uH ±20% 800mA 130mΩ AEC-Q200 SMD 0805; Core Material: Ferrite; Test Frequency: 2MHz; DC Resistance (DCR): 130mR; Saturation Current: 700mA; Height: 1.25mm; Min Operating Temperature: -55°C; Max DC Current: 800mA; Mount: Surface Mount; Height - Seated (Max): 0.057inch; Tolerance: 20%; Package Quantity: 2000; Case/Package: 0805; Current Rating: 800mA; Inductance: 1uH; Case Code (Metric): 2012; Max Operating Temperature: 125°C; RoHS Compliant: Yes; Case Code (Imperial): 0805; Shielding: Shielded; Ratings: AEC-Q200; Length: 0.079inch; Termination: SMD/SMT; Packaging: Tape and Reel; Width: 0.049inch; Weight: 0.000194oz
L15 = CMP-97513-000003-1: BALUN 300KHZ-200MHZ 1:1 6SMD; Insertion Loss: 1.5dB; Lead/Base Style: Gull Wing; Max DC Current: 500mA; Power Rating: 500mW; Package Quantity: 2000; Lead Free: Lead Free; Case/Package: SMD/SMT; Number of Pins: 5; Width: 3.81mm; Turns Ratio: 1:1; Depth: 3.81mm; Height: 2.67mm; Min Operating Temperature: -40°C; Termination: SMD/SMT; Length: 3.81mm; Max Operating Temperature: 85°C; Packaging: Tape and Reel; Radiation Hardening: No; Mount: Surface Mount

## Sheet AFE.SchDoc
size A; SheetNumber: 7; SheetTotal: 12
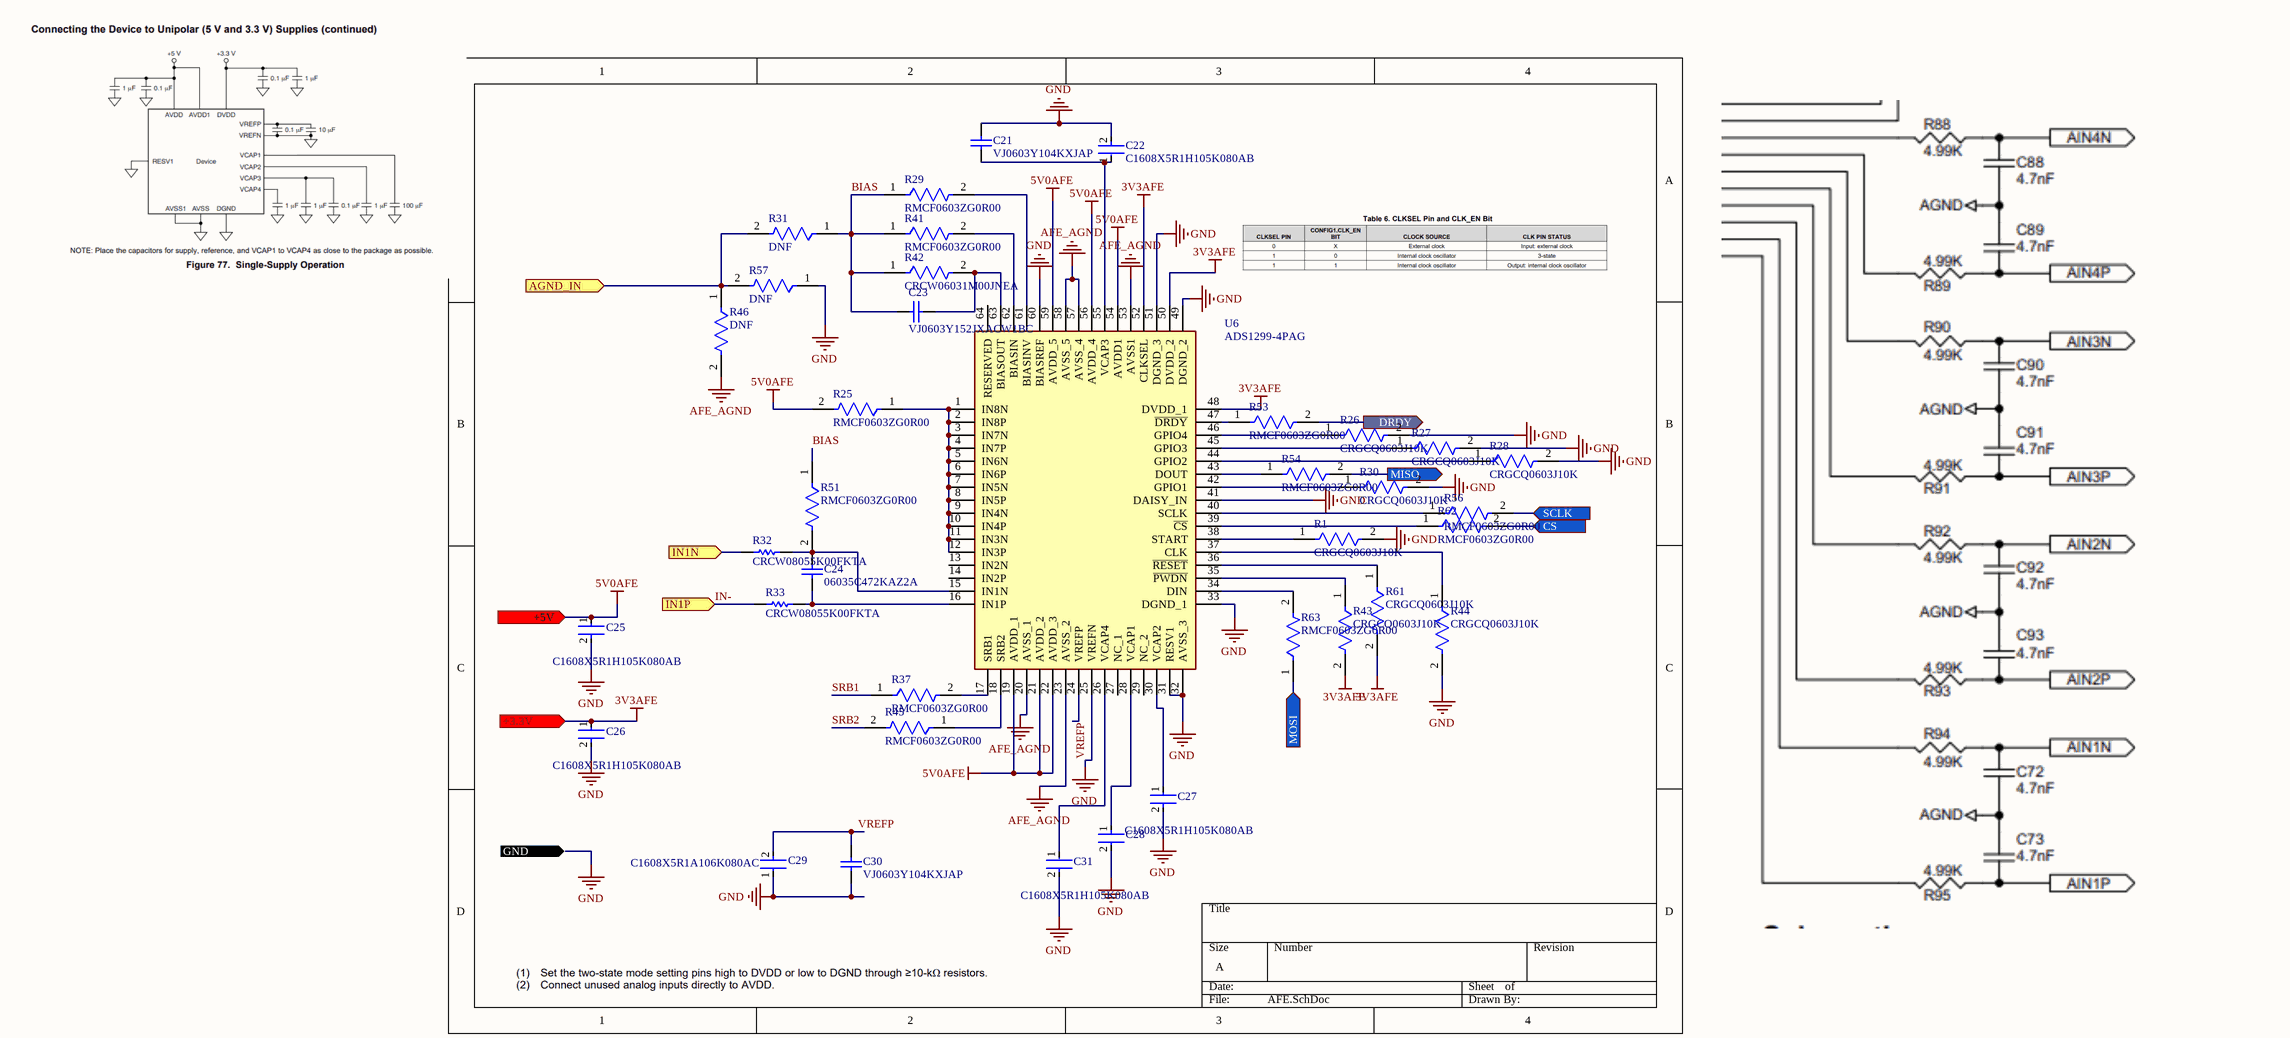
[diagram p5: AFE.SchDoc]

### Parts
C21  VJ0603Y104KXJAP  [CAPC1608X92X38NL15T08]
C22  C1608X5R1H105K080AB  [FP-C1608-080-0_1-IPC_B]
C23  VJ0603Y152JXACW1BC  [CAPC1608X95X40NL15T15]
C24  06035C472KAZ2A  [CAPC1608X90X35LL15T15]
C25  C1608X5R1H105K080AB  [FP-C1608-080-0_1-IPC_B]
C26  C1608X5R1H105K080AB  [FP-C1608-080-0_1-IPC_B]
C27  C1608X5R1H105K080AB  [FP-C1608-080-0_1-IPC_B]
C28  GRM21BR60J107ME15K  [FP-GRM21B-0_2-e0_2_0_7-IPC_B]  (value not drawn)
C29  C1608X5R1A106K080AC  [FP-C1608-080-0_1-MFG]
C30  VJ0603Y104KXJAP  [CAPC1608X92X38NL15T08]
C31  C1608X5R1H105K080AB  [FP-C1608-080-0_1-IPC_B]
R1  CRGCQ0603J10K  [FP-CRGCQ0603-IPC_C]
R25  RMCF0603ZG0R00  [FP-RMCF0603-IPC_B]
R26  CRGCQ0603J10K  [FP-CRGCQ0603-IPC_C]
R27  CRGCQ0603J10K  [FP-CRGCQ0603-IPC_C]
R28  CRGCQ0603J10K  [FP-CRGCQ0603-IPC_C]
R29  RMCF0603ZG0R00  [FP-RMCF0603-IPC_B]
R30  CRGCQ0603J10K  [FP-CRGCQ0603-IPC_C]
R31  DNF  [FP-RMCF0603-IPC_B]
R32  CRCW08055K00FKTA  [RESC2013X50X30ML20T20]
R33  CRCW08055K00FKTA  [RESC2013X50X30ML20T20]
R37  RMCF0603ZG0R00  [FP-RMCF0603-IPC_B]
R41  RMCF0603ZG0R00  [FP-RMCF0603-IPC_B]
R42  CRCW06031M00JNEA  [FP-CRCW0603-e3-IPC_B]
R43  CRGCQ0603J10K  [FP-CRGCQ0603-IPC_C]
R44  CRGCQ0603J10K  [FP-CRGCQ0603-IPC_C]
R45  RMCF0603ZG0R00  [FP-RMCF0603-IPC_B]
R46  DNF  [FP-RMCF0603-IPC_B]
R51  RMCF0603ZG0R00  [FP-RMCF0603-IPC_B]
R53  RMCF0603ZG0R00  [FP-RMCF0603-IPC_B]
R54  RMCF0603ZG0R00  [FP-RMCF0603-IPC_B]
R56  RMCF0603ZG0R00  [FP-RMCF0603-IPC_B]
R57  DNF  [FP-RMCF0603-IPC_B]
R61  CRGCQ0603J10K  [FP-CRGCQ0603-IPC_C]
R62  RMCF0603ZG0R00  [FP-RMCF0603-IPC_B]
R63  RMCF0603ZG0R00  [FP-RMCF0603-IPC_B]
U6  ADS1299-4PAG  [QFP50P1200X1200X120-64N]

### Ports
+3.3V (in), +5V (in), AGND_IN (in), CS (in), DRDY (out), GND (in), IN1N (in), IN1P (in), MISO (out), MOSI (in), SCLK (in)

### Nets
3V3AFE: C26.1 R43.2 R61.2 U6.48(DVDD_1) U6.50(DVDD_2) U6.52(CLKSEL) ; port +3.3V  [project net 3V3]
5V0AFE: C25.1 R25.2 U6.19(AVDD_1) U6.21(AVDD_2) U6.22(AVDD_3) U6.54(AVDD1) U6.56(AVDD_4) U6.59(AVDD_5) ; port +5V  [project net 5V0]
AFE_AGND: R46.2 U6.20(AVSS_1) U6.23(AVSS_2) U6.53(AVSS1) U6.57(AVSS_4) U6.58(AVSS_5)
GND: C21.2 C22.2 C25.2 C26.2 C27.2 C28.2 C29.1 C30.1 C31.2 R1.2 R26.2 R27.2 R28.2 R30.2 R44.2 R57.1 U6.25(VREFN) U6.31(RESV1) U6.32(AVSS_3) U6.33(DGND_1) U6.41(DAISY_IN) U6.49(DGND_2) U6.51(DGND_3) U6.60(BIASREF) ; port GND
BIAS: C23.1 R29.1 R31.1 R41.1 R42.1 R51.1
CS: R62.2 ; port CS
DRDY: R53.2 ; port DRDY
IN-: R33.1 ; port IN1P
PICO: R63.1 ; port MOSI
POCI: R54.2 ; port MISO
SCK: R56.2 ; port SCLK
SRB1: R37.1
SRB2: R45.2
VREFP: C29.2 C30.2 U6.24(VREFP)
NetC21_1: C21.1 C22.1 U6.55(VCAP3)
NetC23_2: C23.2 R42.2 U6.63(BIASOUT)
NetC24_1: C24.1 R32.2 R51.2 U6.15(IN1N)
NetC24_2: C24.2 R33.2 U6.16(IN1P)
NetC27_1: C27.1 U6.30(VCAP2)
NetC28_1: C28.1 U6.28(VCAP1)
NetC31_1: C31.1 U6.26(VCAP4)
NetP1_2: R32.1 ; port IN1N
NetP3_1: R31.2 R46.1 R57.2 ; port AGND_IN
NetR1_1: R1.1 U6.38(START)
NetR25_1: R25.1 U6.1(IN8N) U6.2(IN8P) U6.3(IN7N) U6.4(IN7P) U6.5(IN6N) U6.6(IN6P) U6.7(IN5N) U6.8(IN5P) U6.9(IN4N) U6.10(IN4P) U6.11(IN3N) U6.12(IN3P)
NetR26_1: R26.1 U6.46(GPIO4)
NetR27_1: R27.1 U6.45(GPIO3)
NetR28_1: R28.1 U6.44(GPIO2)
NetR29_2: R29.2 U6.61(BIASINV)
NetR30_1: R30.1 U6.42(GPIO1)
NetR37_2: R37.2 U6.17(SRB1)
NetR41_2: R41.2 U6.62(BIASIN)
NetR43_1: R43.1 U6.35(~{PWDN})
NetR44_1: R44.1 U6.37(CLK)
NetR45_1: R45.1 U6.18(SRB2)
NetR53_1: R53.1 U6.47(~{DRDY})
NetR54_1: R54.1 U6.43(DOUT)
NetR56_1: R56.1 U6.40(SCLK)
NetR61_1: R61.1 U6.36(~{RESET})
NetR62_1: R62.1 U6.39(~{CS})
NetR63_2: R63.2 U6.34(DIN)

Not connected (* = marked no-connect by the designer): U6 13(IN2N) 14(IN2P) 27(NC_1) 29(NC_2) 64(RESERVED)

### Library data of the parts
C21 C30 = CMP-2006-01211-1: Manufacturer: Vitramon; Part Number: VJ0603Y104KXJAP
C22 C25-C27 C31 = CMP-2000-06025-2: Multilayer Ceramic Capacitors 1μF ±10% 50V X5R SMD 0603; Capacitance: 1uF; Lead Free: Lead Free; Height: 0.8mm; Mount: Surface Mount; Radiation Hardening: No; Thickness: 0.035inch; Length: 1.6mm; Max Operating Temperature: 85°C; REACH SVHC: No SVHC; Min Operating Temperature: -55°C; Construction: Flat; RoHS Compliant: Yes; Voltage Rating: 50V; Dielectric: X5R; Packaging: Tape and Reel; Termination: SMD/SMT; Voltage Rating (DC): 50V; Case Code (Imperial): 0603; Voltage: 50V; Width: 0.031inch; Weight: 7.1E-05oz; Depth: 0.8mm; Case Code (Metric): 1608; Series: C; Case/Package: 0603; Tolerance: 10%; Resistor Type: Ceramic; Number of Pins: 2; Dielectric Material: Ceramic; Package Quantity: 1
C23 = CMP-2006-01561-1: Manufacturer: Vitramon; Part Number: VJ0603Y152JXACW1BC
C24 = CMP-2006-04440-1: Manufacturer: AVX Interconnect / Elco; Part Number: 06035C472KAZ2A
C28 = CMP-06035-052658-1: as C61 on sheet System; Voltage Rating (DC): 6.3V; Lead Free: Lead Free; Length: 2mm; Tolerance: 20%; Width: 1.25mm; Capacitance: 100uF; Dielectric: X5R; Thickness: 1.25mm
C29 = CMP-2000-04979-3: as C1 on sheet MCU; Dielectric Material: Ceramic; Construction: Flat; Height: 0.8mm; Thickness: 0.035inch; Case Code (Metric): 1608; Radiation Hardening: No; Number of Pins: 2; Voltage Rating (DC): 10V; Depth: 0.8mm; Voltage: 10V; RoHS Compliant: Yes; Voltage Rating: 10V; Package Quantity: 1; Resistor Type: Ceramic; Termination: SMD/SMT; Lead Free: Lead Free; REACH SVHC: No SVHC; Tolerance: 10%; Mount: Surface Mount; Series: C; Packaging: Tape and Reel; Width: 0.8mm; Dielectric: X5R; Weight: 7.1E-05oz; Length: 1.6mm; Max Operating Temperature: 85°C; Case Code (Imperial): 0603; Case/Package: 0603; Min Operating Temperature: -55°C
R1 R26-R28 R30 R43 R44 R61 = CMP-03211-009884-1: as R24 on sheet DDS; Composition: Thick Film; ComponentLink2URL: https://www.te.com/commerce/DocumentDelivery/DDEController?Action=showdoc&DocId=Data+Sheet%7F1773204-3%7F1%7Fpdf%7FEnglish%7FENG_DS_1773204-3_1.pdf%7F4-2176339-923; Device Class L1: Passive Components; Package: CRGCQ0603; Mouser Description: Res Thick Film 0603 10K Ohm 5% 0.1W(1/10W) ±100ppm/C Pad SMD Automotive T/R; Temperature Range High: +155°C; Category: Res; Device Class L2: Resistors; Height: 0.55mm; RoHS: TRUE; Lead Free: Yes; Ipc Land Pattern Name: RESC16080X45; Temperature: -55°C to +155°C; Series: CRGCQ; Digikey Description: CRGCQ 0603 10K 5%; Octopart: https://octopart.com/crgcq0603j10k-te+connectivity-91018097; Device Class L3: Chip SMD Resistors; Ambient Temperature Range High: +70°C; ComponentLink2Description: Datasheet; Temperature Range Low: -55°C; Manufacturer Part Number: CRGCQ0603J10K
R25 R29 R31 R37 R41 R45 R46 R51 R53 R54 R56 R57 R62 R63 = CMP-26527-006412-1: as R8 on sheet System; Width: 0.031inch; RoHS Compliant: Yes; Number of Terminations: 2; Case/Package: 0603; Contact Plating: Tin; Height: 0.022inch; Resistor Type: Thick Film; Mount: Surface Mount; Length: 0.061inch; Features: Automotive AEC-Q200; Series: RMCF; Max Operating Temperature: 155°C; Radiation Hardening: No; Min Operating Temperature: -55°C; Packaging: Tape and Reel
R32 R33 = CMP-2001-04239-1: Manufacturer: Vishay Dale; Part Number: CRCW08055K00FKTA
R42 = CMP-2000-03016-2: RES Thick Film, 1MΩ, 5%, 0.1W, 200ppm/°C, 0603; Max Power Dissipation: 100mW; Resistance: 1MR; Voltage Rating: 75V; Temperature Coefficient: 200ppm/°C; Military Standard: Not; Mount: Surface Mount; Package Quantity: 1; Number of Pins: 2; Power Rating: 100mW; Packaging: Tape and Reel; Length: 1.55mm; Width: 0.85mm; Height: 0.02inch; Min Operating Temperature: -55°C; Tolerance: 5%; Depth: 0.85mm; Composition: Thick Film; Number of Terminations: 2; Max Operating Temperature: 155°C; Termination: SMD/SMT; Case Code (Imperial): 0603; Weight: 7.1E-05oz; Case Code (Metric): 1608; Radiation Hardening: No; Contact Plating: Tin; Case/Package: 0603; Features: Automotive AEC-Q200
U6 = ADS1299-4PAG: Low-Noise, 4-Channel, 24-Bit Analog-to-Digital Converter for Biopotential Measurements; Manufacturer_Name: Texas Instruments; Geometry.Height: 1.2mm; Mouser Part Number: 595-ADS1299-4PAG; Mouser Price/Stock: https://www.mouser.co.uk/ProductDetail/Texas-Instruments/ADS1299-4PAG?qs=9lcNTSmDlCovTG3JfbaYgg%3D%3D; Manufacturer_Part_Number: ADS1299-4PAG; Datasheet Link: http://www.ti.com/lit/gpn/ads1299-4

## Nets that join several sheets
3V3: System (J2.9 R12.2), MCU (5 pins), DDS (Y1.4), AFE (6 pins)
3V3DDS: System (R12.1), DDS (10 pins)
5V0: System (J2.8), AFE (8 pins)
13V0PA: System (R8.1), PA stage 2 (C36.2 C38.2 L3.2)
GND: System (44 pins), MCU (5 pins), DDS (17 pins), PA stage 2 (13 pins), Output (L15.2 L15.5), AFE (24 pins)
CS: System (J8.9), MCU (U1.19), AFE (R62.2)
D7: System (J1.4), MCU (U1.20), DDS (U4.25)
DDS_OUT: System (R16.2), DDS (R21.1 U4.21)
DDS_RST: System (J1.3), MCU (U1.13), DDS (U4.22)
DDS_WCLK: System (J1.1), MCU (U1.18), DDS (U4.7)
DRDY: System (J8.6), MCU (U1.10), AFE (R53.2)
FQ_UD: System (J1.2), MCU (U1.17), DDS (U4.8)
IN-: System (P1.1), AFE (R33.1)
NetC39_1: System (R10.2), PA stage 2 (C39.1 L4.2)
NetC40_2: System (R13.2), PA stage 2 (C40.2), Output (L15.4)
NetL14_1: System (R9.1), Output (L14.1 L15.3 L16.2)
NetL15_1: System (R17.2), Output (L15.1 L16.1 L17.2)
NetP1_2: System (P1.2), AFE (R32.1)
NetP3_1: System (P3.1), AFE (R31.2 R46.1 R57.2)
NetU1_8: MCU (U1.8), DDS (Y1.1)
NRST: System (J2.4), MCU (R2.1 U1.5)
PICO: System (J8.10), MCU (U1.14), AFE (R63.1)
POCI: System (J8.7), MCU (U1.12), AFE (R54.2)
SCK: System (J8.8), MCU (U1.11), AFE (R56.2)
SWCLK: System (J2.5), MCU (U1.16)
SWDIO: System (J2.6), MCU (U1.15)
TXD: System (J1.6), MCU (U1.2)
UART_Rx: System (J1.5), MCU (U1.1)